# Altium schematic sheet Bandpass.SchDoc
size A4; Organization: Altium Limited; Address1: L3, 12a Rodborough Rd; Address2: Frenchs Forest; Address3: NSW; Address4: Australia 2086; DocumentNumber: 1; SheetNumber: 1; SheetTotal: 1
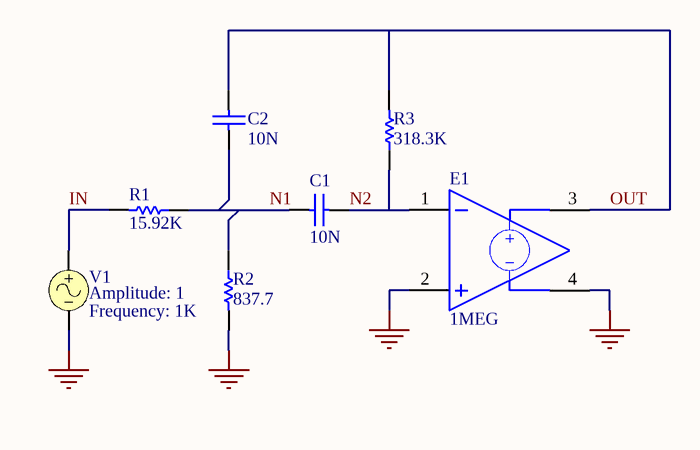
[diagram p0: Bandpass.SchDoc]

## Parts
C1  10N  [RAD-0.3]
C2  10N  [RAD-0.3]
E1  1MEG
R1  15.92K  [AXIAL-0.3]
R2  837.7  [AXIAL-0.3]
R3  318.3K  [AXIAL-0.3]
V1  Amplitude: 1  Frequency: 1K  (hidden comment: VSIN)

## Nets
GND: E1.2(+IN) E1.4(OUT-) R2.2 V1.2
IN: R1.2 V1.1
N1: C1.1 C2.1 R1.1 R2.1
N2: C1.2 E1.1(-IN) R3.1
OUT: C2.2 E1.3(OUT+) R3.2

## Notes on the sheet
- Title
- Size:
- Date:
- A4
- Number:
- Time:
- Revision:
- Sheet
- of
- File:

## Library data of the parts
C1 C2 = Cap: Capacitor; Manufacturer: Generic Components; Class I: Passive; Published: 8-Jun-2000; Revision: July-2002: Re-released for DXP Platform.; Publisher: Altium Limited; Class II: Capacitor; Value: 10N
E1 = VCVS: Gain: 1MEG
R1-R3 = Res1: Resistor; Manufacturer: Generic Components; Class I: Passive; Published: 8-Jun-2000; Revision: July-2002: Re-released for DXP Platform.; Publisher: Altium Limited; Class II: Resistor
  R1: Value: 15.92K
  R2: Value: 837.7
  R3: Value: 318.3K
V1 = VSIN: Sinusoidal Voltage Source; Manufacturer: Generic Components; Revision 1: 15-Jun-2001: Default value added for damping factor (F8:0).; Revision 2: 17-July-2002: Re-released for DXP Platform.; Class I: Simulation; Note: PCB Footprint - Not required; Published: 8-Jun-2000; Package Reference: Not Applicable; Publisher: Altium Limited; Class II: Voltage Source